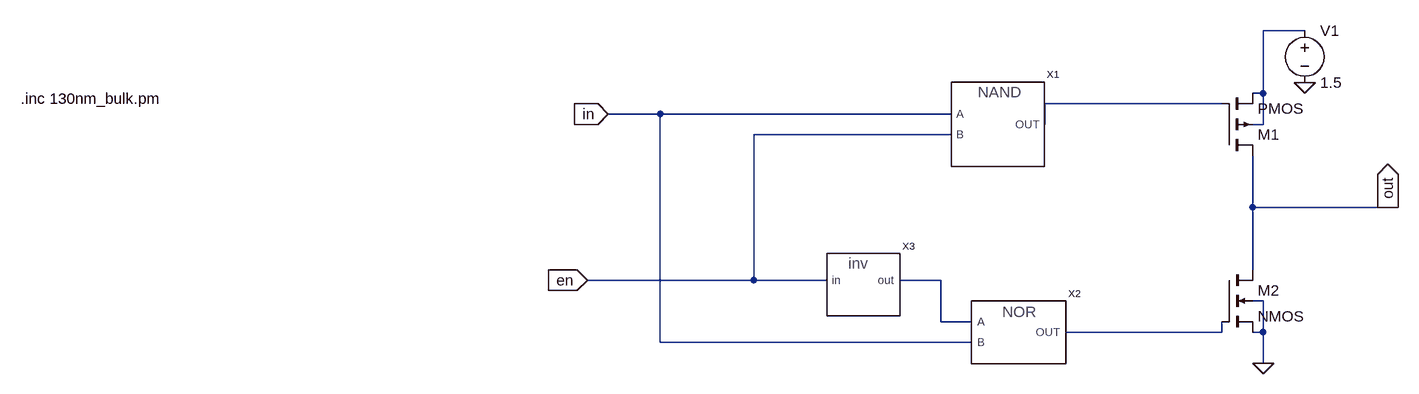
[diagram p0: schematic Three_state_new.asc]
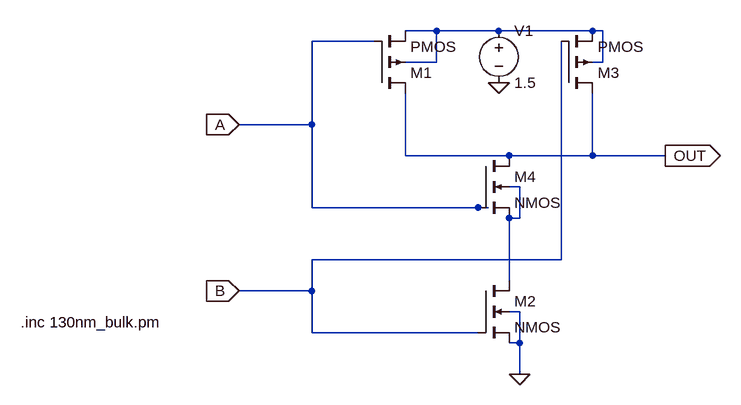
[diagram p1: sub-circuit nand.asc]
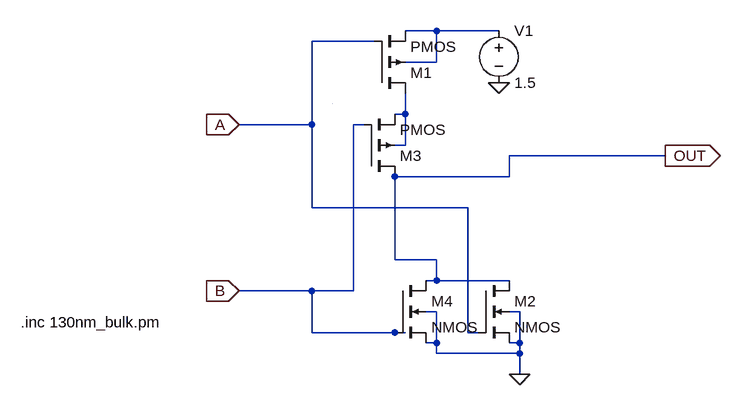
[diagram p2: sub-circuit nor.asc]
Three_state_new.asc, the LTspice schematic file:
Version 4
SHEET 1 1252 680
WIRE 576 -384 512 -384
WIRE 512 -288 512 -384
WIRE 512 -288 496 -288
WIRE 448 -272 176 -272
WIRE -416 -256 -496 -256
WIRE 32 -256 -416 -256
WIRE 176 -240 176 -272
WIRE 512 -240 512 -288
WIRE 512 -240 496 -240
WIRE 32 -224 -272 -224
WIRE 496 -112 496 -192
WIRE 704 -112 496 -112
WIRE 720 -112 704 -112
WIRE 496 -16 496 -112
WIRE -272 0 -272 -224
WIRE -272 0 -528 0
WIRE -160 0 -272 0
WIRE 16 0 -48 0
WIRE 512 32 496 32
WIRE 16 64 16 0
WIRE 64 64 16 64
WIRE 448 80 448 64
WIRE 448 80 208 80
WIRE 512 80 512 32
WIRE 512 80 496 80
WIRE -416 96 -416 -256
WIRE 64 96 -416 96
WIRE 512 128 512 80
FLAG -496 -256 in
IOPIN -496 -256 In
FLAG 512 128 0
FLAG 576 -304 0
FLAG 704 -112 out
IOPIN 704 -112 Out
FLAG -528 0 en
IOPIN -528 0 In
SYMBOL NAND 80 -240 R0
SYMATTR InstName X1
SYMBOL NOR 128 64 R0
SYMATTR InstName X2
SYMBOL invert -112 16 R0
SYMATTR InstName X3
SYMBOL pmos4 448 -192 M180
SYMATTR InstName M1
SYMATTR Value2 l=130e-9 w=2600e-9 ad=676000e-18 as=676000e-18 pd=3640e-9 ps=3640e-9
SYMBOL nmos4 448 -16 R0
SYMATTR InstName M2
SYMATTR Value2 l=130e-9 w=1560e-9 ad=676000e-18 as=676000e-18 pd=3640e-9 ps=3640e-9
SYMBOL voltage 576 -400 R0
WINDOW 123 0 0 Left 0
WINDOW 39 0 0 Left 0
SYMATTR InstName V1
SYMATTR Value 1.5
TEXT -1400 -280 Left 2 !.inc 130nm_bulk.pm

nand.asc, the sub-circuit schematic file:
Version 4
SHEET 1 880 680
WIRE 304 -256 256 -256
WIRE 400 -256 304 -256
WIRE 544 -256 400 -256
WIRE 560 -256 544 -256
WIRE 208 -240 112 -240
WIRE 304 -208 304 -256
WIRE 304 -208 256 -208
WIRE 560 -208 560 -256
WIRE 560 -208 544 -208
WIRE 112 -112 112 -240
WIRE 112 -112 0 -112
WIRE 256 -64 256 -160
WIRE 416 -64 256 -64
WIRE 544 -64 544 -160
WIRE 544 -64 416 -64
WIRE 656 -64 544 -64
WIRE 432 -16 416 -16
WIRE 112 16 112 -112
WIRE 368 16 112 16
WIRE 384 16 368 16
WIRE 432 32 432 -16
WIRE 432 32 416 32
WIRE 496 96 496 -240
WIRE 496 96 112 96
WIRE 416 128 416 32
WIRE 112 144 112 96
WIRE 112 144 0 144
WIRE 432 176 416 176
WIRE 112 208 112 144
WIRE 368 208 112 208
WIRE 432 224 432 176
WIRE 432 224 416 224
WIRE 432 272 432 224
FLAG 432 272 0
FLAG 400 -176 0
FLAG 656 -64 OUT
IOPIN 656 -64 Out
FLAG 0 -112 A
IOPIN 0 -112 In
FLAG 0 144 B
IOPIN 0 144 In
SYMBOL pmos4 208 -160 M180
SYMATTR InstName M1
SYMATTR Value2 l=130e-9 w=2600e-9 ad=676000e-18 as=676000e-18 pd=3640e-9 ps=3640e-9
SYMBOL nmos4 368 128 R0
SYMATTR InstName M2
SYMATTR Value2 l=130e-9 w=1300e-9 ad=676000e-18 as=676000e-18 pd=3640e-9 ps=3640e-9
SYMBOL pmos4 496 -160 M180
SYMATTR InstName M3
SYMATTR Value2 l=130e-9 w=2600e-9 ad=676000e-18 as=676000e-18 pd=3640e-9 ps=3640e-9
SYMBOL nmos4 368 -64 R0
SYMATTR InstName M4
SYMATTR Value2 l=130e-9 w=1300e-9 ad=676000e-18 as=676000e-18 pd=3640e-9 ps=3640e-9
SYMBOL voltage 400 -272 R0
WINDOW 123 0 0 Left 0
WINDOW 39 0 0 Left 0
SYMATTR InstName V1
SYMATTR Value 1.5
TEXT -336 192 Left 2 !.inc 130nm_bulk.pm

nor.asc, the sub-circuit schematic file:
Version 4
SHEET 1 880 680
WIRE 160 -112 112 -112
WIRE 256 -112 160 -112
WIRE 64 -96 -32 -96
WIRE 160 -64 160 -112
WIRE 160 -64 112 -64
WIRE 112 16 112 -16
WIRE 112 16 96 16
WIRE -32 32 -32 -96
WIRE -32 32 -144 32
WIRE 48 32 32 32
WIRE 112 64 112 16
WIRE 112 64 96 64
WIRE 512 80 272 80
WIRE 272 112 272 80
WIRE 272 112 96 112
WIRE -32 160 -32 32
WIRE 208 160 -32 160
WIRE 96 240 96 112
WIRE 160 240 96 240
WIRE 160 272 160 240
WIRE 160 272 144 272
WIRE 272 272 160 272
WIRE -32 288 -144 288
WIRE 32 288 32 32
WIRE 32 288 -32 288
WIRE 160 320 144 320
WIRE 288 320 272 320
WIRE -32 352 -32 288
WIRE 96 352 -32 352
WIRE 112 352 96 352
WIRE 208 352 208 160
WIRE 224 352 208 352
WIRE 160 368 160 320
WIRE 160 368 144 368
WIRE 288 368 288 320
WIRE 288 368 272 368
WIRE 160 384 160 368
WIRE 288 384 288 368
WIRE 288 384 160 384
WIRE 288 416 288 384
WIRE 0 0 0 0
FLAG 288 416 0
FLAG 256 -32 0
FLAG 512 80 OUT
IOPIN 512 80 Out
FLAG -144 32 A
IOPIN -144 32 In
FLAG -144 288 B
IOPIN -144 288 In
SYMBOL pmos4 64 -16 M180
SYMATTR InstName M1
SYMATTR Value2 l=130e-9 w=2600e-9 ad=676000e-18 as=676000e-18 pd=3640e-9 ps=3640e-9
SYMBOL nmos4 224 272 R0
SYMATTR InstName M2
SYMATTR Value2 l=130e-9 w=1300e-9 ad=676000e-18 as=676000e-18 pd=3640e-9 ps=3640e-9
SYMBOL pmos4 48 112 M180
SYMATTR InstName M3
SYMATTR Value2 l=130e-9 w=2600e-9 ad=676000e-18 as=676000e-18 pd=3640e-9 ps=3640e-9
SYMBOL nmos4 96 272 R0
SYMATTR InstName M4
SYMATTR Value2 l=130e-9 w=1300e-9 ad=676000e-18 as=676000e-18 pd=3640e-9 ps=3640e-9
SYMBOL voltage 256 -128 R0
WINDOW 123 0 0 Left 0
WINDOW 39 0 0 Left 0
SYMATTR InstName V1
SYMATTR Value 1.5
TEXT -480 336 Left 2 !.inc 130nm_bulk.pm

The netlist it stands for:
* Three_state_new.asc
XX1 in en N002 nand
XX2 N003 in N004 nor
XX3 en N003 invert  ; pins in out
M1 out N002 N001 N001 PMOS l=130e-9 w=2600e-9 ad=676000e-18 as=676000e-18 pd=3640e-9 ps=3640e-9
M2 out N004 0 0 NMOS l=130e-9 w=1560e-9 ad=676000e-18 as=676000e-18 pd=3640e-9 ps=3640e-9
V1 N001 0 1.5

* block symbol definitions
.subckt nand A B OUT
M1 OUT A N001 N001 PMOS l=130e-9 w=2600e-9 ad=676000e-18 as=676000e-18 pd=3640e-9 ps=3640e-9
M2 N002 B 0 0 NMOS l=130e-9 w=1300e-9 ad=676000e-18 as=676000e-18 pd=3640e-9 ps=3640e-9
M3 OUT B N001 N001 PMOS l=130e-9 w=2600e-9 ad=676000e-18 as=676000e-18 pd=3640e-9 ps=3640e-9
M4 OUT A N002 N002 NMOS l=130e-9 w=1300e-9 ad=676000e-18 as=676000e-18 pd=3640e-9 ps=3640e-9
V1 N001 0 1.5
.inc 130nm_bulk.pm
.ends nand

.subckt nor A B OUT
M1 N002 A N001 N001 PMOS l=130e-9 w=2600e-9 ad=676000e-18 as=676000e-18 pd=3640e-9 ps=3640e-9
M2 OUT A 0 0 NMOS l=130e-9 w=1300e-9 ad=676000e-18 as=676000e-18 pd=3640e-9 ps=3640e-9
M3 OUT B N002 N002 PMOS l=130e-9 w=2600e-9 ad=676000e-18 as=676000e-18 pd=3640e-9 ps=3640e-9
M4 OUT B 0 0 NMOS l=130e-9 w=1300e-9 ad=676000e-18 as=676000e-18 pd=3640e-9 ps=3640e-9
V1 N001 0 1.5
.inc 130nm_bulk.pm
.ends nor

.model NMOS NMOS
.model PMOS PMOS
.lib standard.mos
.inc 130nm_bulk.pm
.backanno
.end